# Altium schematic sheet pcie_power.SchDoc: PCIe bridge
size 297 x 209 mm; CheckedBy: MC, TW, EB; CompanyName: CERN; DrawnBy: Greg Kasprowicz; Organization: CERN; Address1: European Organization for Nuclear Research; Address2: CH-1211 Geneve 23 - Switzerland; DocumentNumber: 13; Revision: -; SheetNumber: 13; SheetTotal: 17; EDA_Number: EDA-02189-V4-0; Projet: Simple PCIe Carrier Board; Title2: Power supplies; Designer: GK, MC, TW, EB, PAS; DivGrp: BE-CO; CreateDate: 10/07/2010; CheckedDate: 11/05/2011; ModifiedBy: TW, MC; DocumentName: pcie_power.SchDoc
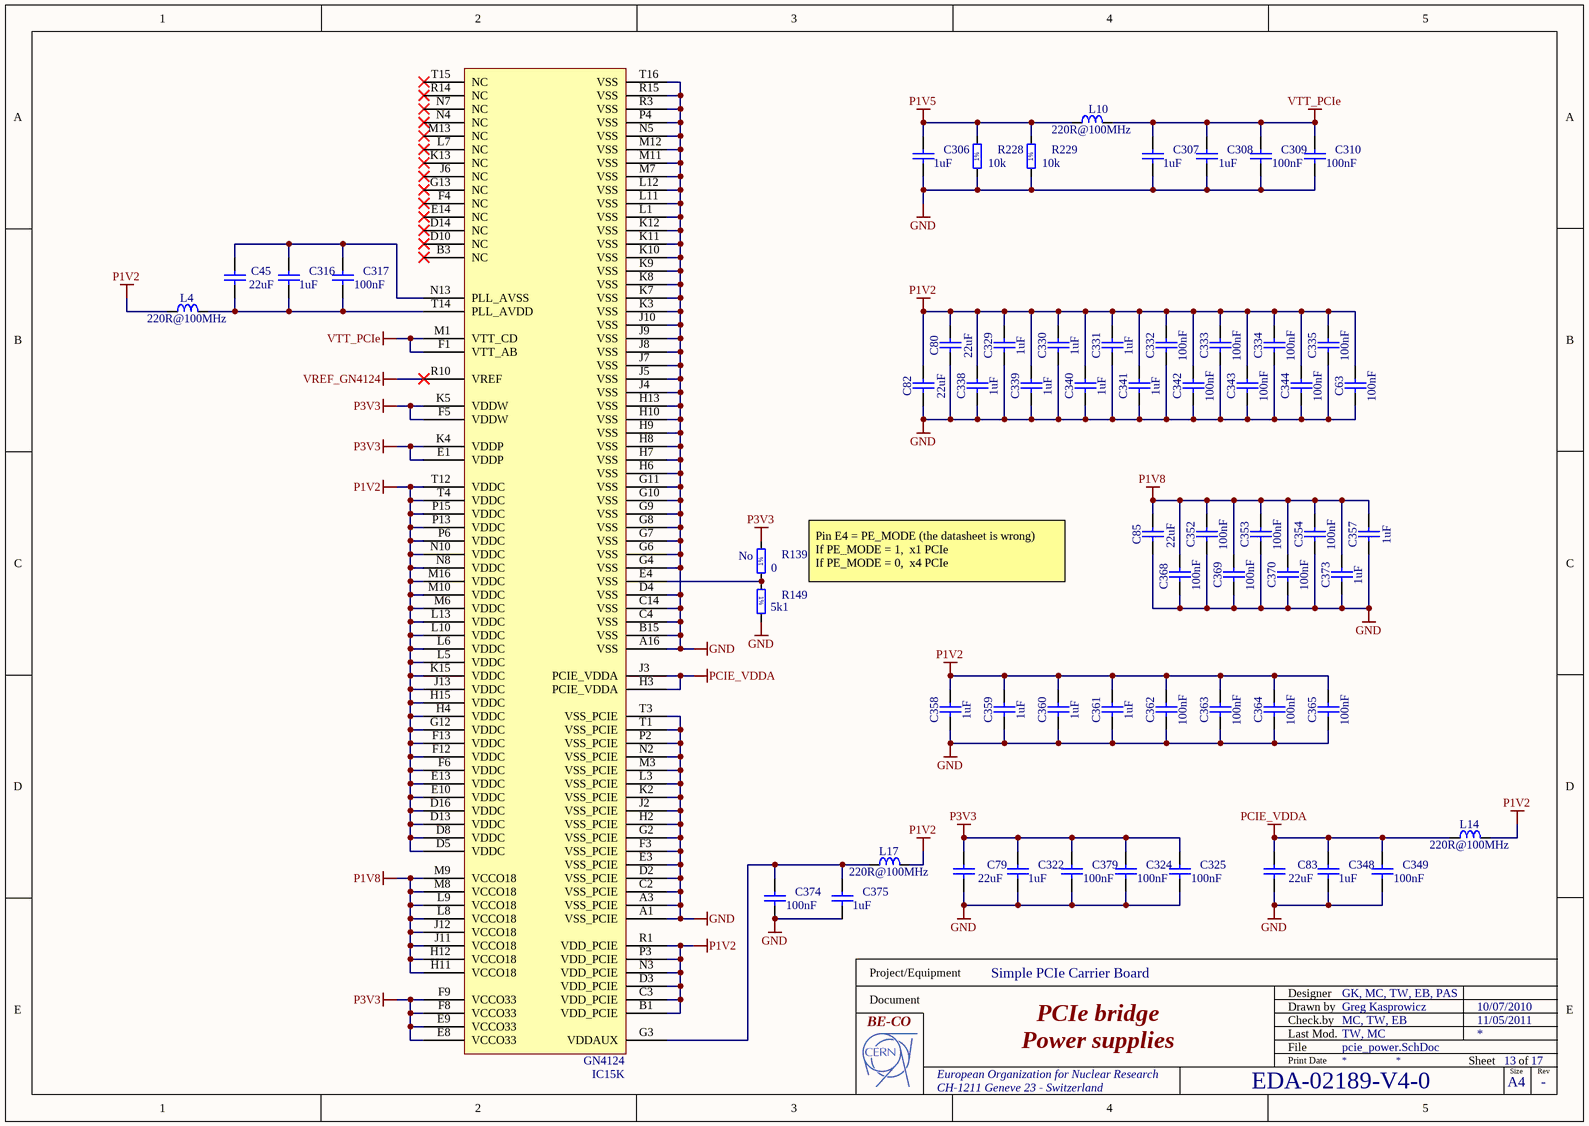
[diagram p0: pcie_power.SchDoc]

## Parts
C45  22uF  [CAPC3216X180N]
C63  100nF  [CAPC1005X55N]
C79  22uF  [CAPC3216X180N]
C80  22uF  [CAPC3216X180N]
C82  22uF  [CAPC3216X180N]
C83  22uF  [CAPC3216X180N]
C85  22uF  [CAPC3216X180N]
C306  1uF  [CAPC1608X87N]
C307  1uF  [CAPC1608X87N]
C308  1uF  [CAPC1608X87N]
C309  100nF  [CAPC1005X55N]
C310  100nF  [CAPC1005X55N]
C316  1uF  [CAPC1608X87N]
C317  100nF  [CAPC1005X55N]
C322  1uF  [CAPC1608X87N]
C324  100nF  [CAPC1005X55N]
C325  100nF  [CAPC1005X55N]
C329  1uF  [CAPC1608X87N]
C330  1uF  [CAPC1608X87N]
C331  1uF  [CAPC1608X87N]
C332  100nF  [CAPC1005X55N]
C333  100nF  [CAPC1005X55N]
C334  100nF  [CAPC1005X55N]
C335  100nF  [CAPC1005X55N]
C338  1uF  [CAPC1608X87N]
C339  1uF  [CAPC1608X87N]
C340  1uF  [CAPC1608X87N]
C341  1uF  [CAPC1608X87N]
C342  100nF  [CAPC1005X55N]
C343  100nF  [CAPC1005X55N]
C344  100nF  [CAPC1005X55N]
C348  1uF  [CAPC1608X87N]
C349  100nF  [CAPC1005X55N]
C352  100nF  [CAPC1005X55N]
C353  100nF  [CAPC1005X55N]
C354  100nF  [CAPC1005X55N]
C357  1uF  [CAPC1608X87N]
C358  1uF  [CAPC1608X87N]
C359  1uF  [CAPC1608X87N]
C360  1uF  [CAPC1608X87N]
C361  1uF  [CAPC1608X87N]
C362  100nF  [CAPC1005X55N]
C363  100nF  [CAPC1005X55N]
C364  100nF  [CAPC1005X55N]
C365  100nF  [CAPC1005X55N]
C368  100nF  [CAPC1005X55N]
C369  100nF  [CAPC1005X55N]
C370  100nF  [CAPC1005X55N]
C373  1uF  [CAPC1608X87N]
C374  100nF  [CAPC1005X55N]
C375  1uF  [CAPC1608X87N]
C379  100nF  [CAPC1005X55N]
IC15  GN4124  [BGA256C100P16X16_1700X1700X150]  (part K of 11)
L4  220R@100MHz  [INDC2012X105N]
L10  220R@100MHz  [INDC2012X105N]
L14  220R@100MHz  [INDC2012X105N]
L17  220R@100MHz  [INDC2012X105N]
R139  0  Mounted: No  [RESC1608X55N]
R149  5k1  [RESC1608X55N]
R228  10k  [RESC1608X55N]
R229  10k  [RESC1608X55N]

## Nets
GND: C63.1 C79.1 C80.1 C82.1 C83.1 C85.1 C306.1 C307.1 C308.1 C309.1 C310.1 C322.1 C324.1 C325.1 C329.1 C330.1 C331.1 C332.1 C333.1 C334.1 C335.1 C338.1 C339.1 C340.1 C341.1 C342.1 C343.1 C344.1 C348.1 C349.1 C352.1 C353.1 C354.1 C357.1 C358.1 C359.1 C360.1 C361.1 C362.1 C363.1 C364.1 C365.1 C368.2 C369.1 C370.1 C373.1 C374.1 C375.1 C379.1 IC15.A1(VSS_PCIE) IC15.A3(VSS_PCIE) IC15.A16(VSS) IC15.B15(VSS) IC15.C2(VSS_PCIE) IC15.C4(VSS) IC15.C14(VSS) IC15.D2(VSS_PCIE) IC15.D4(VSS) IC15.E3(VSS_PCIE) IC15.F3(VSS_PCIE) IC15.G2(VSS_PCIE) IC15.G4(VSS) IC15.G6(VSS) IC15.G7(VSS) IC15.G8(VSS) IC15.G9(VSS) IC15.G10(VSS) IC15.G11(VSS) IC15.H2(VSS_PCIE) IC15.H6(VSS) IC15.H7(VSS) IC15.H8(VSS) IC15.H9(VSS) IC15.H10(VSS) IC15.H13(VSS) IC15.J2(VSS_PCIE) IC15.J4(VSS) IC15.J5(VSS) IC15.J7(VSS) IC15.J8(VSS) IC15.J9(VSS) IC15.J10(VSS) IC15.K2(VSS_PCIE) IC15.K3(VSS) IC15.K7(VSS) IC15.K8(VSS) IC15.K9(VSS) IC15.K10(VSS) IC15.K11(VSS) IC15.K12(VSS) IC15.L1(VSS) IC15.L3(VSS_PCIE) IC15.L11(VSS) IC15.L12(VSS) IC15.M3(VSS_PCIE) IC15.M7(VSS) IC15.M11(VSS) IC15.M12(VSS) IC15.N2(VSS_PCIE) IC15.N5(VSS) IC15.P2(VSS_PCIE) IC15.P4(VSS) IC15.R3(VSS) IC15.R15(VSS) IC15.T1(VSS_PCIE) IC15.T3(VSS_PCIE) IC15.T16(VSS) R149.2 R228.1 R229.1
P1V2: C63.2 C80.2 C82.2 C329.2 C330.2 C331.2 C332.2 C333.2 C334.2 C335.2 C338.2 C339.2 C340.2 C341.2 C342.2 C343.2 C344.2 C358.2 C359.2 C360.2 C361.2 C362.2 C363.2 C364.2 C365.2 IC15.B1(VDD_PCIE) IC15.C3(VDD_PCIE) IC15.D3(VDD_PCIE) IC15.D5(VDDC) IC15.D8(VDDC) IC15.D13(VDDC) IC15.D16(VDDC) IC15.E10(VDDC) IC15.E13(VDDC) IC15.F6(VDDC) IC15.F12(VDDC) IC15.F13(VDDC) IC15.G12(VDDC) IC15.H4(VDDC) IC15.H15(VDDC) IC15.J13(VDDC) IC15.K15(VDDC) IC15.L5(VDDC) IC15.L6(VDDC) IC15.L10(VDDC) IC15.L13(VDDC) IC15.M6(VDDC) IC15.M10(VDDC) IC15.M16(VDDC) IC15.N3(VDD_PCIE) IC15.N8(VDDC) IC15.N10(VDDC) IC15.P3(VDD_PCIE) IC15.P6(VDDC) IC15.P13(VDDC) IC15.P15(VDDC) IC15.R1(VDD_PCIE) IC15.T4(VDDC) IC15.T12(VDDC) L4.1 L14.2 L17.2
P1V5: C306.2 L10.1 R228.2 R229.2
P1V8: C85.2 C352.2 C353.2 C354.2 C357.2 C368.1 C369.2 C370.2 C373.2 IC15.H11(VCCO18) IC15.H12(VCCO18) IC15.J11(VCCO18) IC15.J12(VCCO18) IC15.L8(VCCO18) IC15.L9(VCCO18) IC15.M8(VCCO18) IC15.M9(VCCO18)
P3V3: C79.2 C322.2 C324.2 C325.2 C379.2 IC15.E1(VDDP) IC15.E8(VCCO33) IC15.E9(VCCO33) IC15.F5(VDDW) IC15.F8(VCCO33) IC15.F9(VCCO33) IC15.K4(VDDP) IC15.K5(VDDW) R139.2
PCIE_VDDA: C83.2 C348.2 C349.2 IC15.H3(PCIE_VDDA) IC15.J3(PCIE_VDDA) L14.1
VREF_GN4124: IC15.R10(VREF)
VTT_PCIe: C307.2 C308.2 C309.2 C310.2 IC15.F1(VTT_AB) IC15.M1(VTT_CD) L10.2
NetC45_1: C45.1 C316.2 C317.2 IC15.N13(PLL_AVSS)
NetC45_2: C45.2 C316.1 C317.1 IC15.T14(PLL_AVDD) L4.2
NetC374_2: C374.2 C375.2 IC15.G3(VDDAUX) L17.1
NetIC15_E4: IC15.E4(VSS) R139.1 R149.1

Not connected (* = marked no-connect by the designer): IC15 B3(NC)* D10(NC)* D14(NC)* E14(NC)* F4(NC)* G13(NC)* J6(NC)* K13(NC)* L7(NC)* M13(NC)* N4(NC)* N7(NC)* R14(NC)* T15(NC)*

## Notes on the sheet
- Pin E4 = PE_MODE (the datasheet is wrong)
  If PE_MODE = 1,  x1 PCIe
  If PE_MODE = 0,  x4 PCIe
- Project/Equipment
- Document
- Designer
- Drawn by
- Check.by
- File
- Last Mod.
- Print Date
- Sheet
- Size
- A4
- of
- Rev
- (in symbol R0603_0R_JUMPER) 1%
- (in symbol R0603_5K1_1%_0.1W_100PPM) 1%
- (in symbol R0603_10K_1%_0.1W_100PPM) 1%

## Library data of the parts
C45 C79 C80 C82 C83 C85 = CC1206_22UF_10V_10%_X7R: Non-polarised capacitor; Part Description: SMD Multilayer Chip Ceramic Capacitor; Manufacturer: GENERIC; Manufacturer1 Part Number: GRM31CR71A226KE15L; Voltage: 10V; TC: X7R; Tolerance: ±10%; Table: Capacitors SMD; Part Number: CC1206_22UF_10V_10%_X7R; Component Kind: Standard; Component Type: Standard; Pin Count: 2; Value: 22uF; Status: Preferred; Manufacturer Part Number: CC1206_22UF_10V_10%_X7R; Case: 1206; Mounted: Yes; Socket: No; SMD: Yes; Manufacturer1 Example: MURATA; Manufacturer1 ComponentHeight: 1.8mm; HelpURL: \\cern.ch\dfs\Applications\Altium\Datasheets\CC1206_X7R_MURATA_GRM-HI-CAP.pdf; Author: CERN DEM JLC; CreateDate: 2010-06-08; LatestRevisionDate: 2010-06-08
C63 C309 C310 C317 C324 C325 C332-C335 C342-C344 C349 C352-C354 C362-C365 C368-C370 C374 C379 = CC0402_100NF_16V_10%_X7R: Non-polarised capacitor; Part Description: SMD Multilayer Chip Ceramic Capacitor; Manufacturer: GENERIC; Manufacturer1 Part Number: 223878715649; Voltage: 16V; TC: X7R; Tolerance: ±10%; Table: Capacitors SMD; Part Number: CC0402_100NF_16V_10%_X7R; Component Kind: Standard; Component Type: Standard; Pin Count: 2; Value: 100nF; Status: Not Recommended; Manufacturer Part Number: CC0402_100NF_16V_10%_X7R; Case: 0402; Mounted: Yes; Socket: No; SMD: Yes; Manufacturer1 Example: PHYCOMP; Manufacturer1 ComponentHeight: 0.55mm; HelpURL: \\cern.ch\dfs\Applications\Altium\Datasheets\CC0402_X7R_PHYCOMP.pdf; Author: CERN DEM JLC; CreateDate: 12/3/2007; LatestRevisionDate: 12/3/2007
C306-C308 C316 C322 C329-C331 C338-C341 C348 C357-C361 C375 = CC0603_1UF_16V_10%_X7R: Non-polarised capacitor; Part Description: SMD Multilayer Chip Ceramic Capacitor; Manufacturer: GENERIC; Manufacturer1 Part Number: 223824613663; Voltage: 16V; TC: X7R; Tolerance: ±10%; Table: Capacitors SMD; Part Number: CC0603_1UF_16V_10%_X7R; Component Kind: Standard; Component Type: Standard; Pin Count: 2; Value: 1uF; Status: Preferred; Manufacturer Part Number: CC0603_1uF_16V_10%_X7R; Case: 0603; Mounted: Yes; Socket: No; SMD: Yes; Manufacturer1 Example: PHYCOMP; Manufacturer1 ComponentHeight: 0.87mm; HelpURL: \\cern.ch\dfs\Applications\Altium\Datasheets\CC0805_X5R_PHYCOMP_HC.pdf; Author: CERN DEM JLC
  C306: CreateDate: 03/12/2007; LatestRevisionDate: 03/12/2007
  C307 C308 C316 C322 C329-C331 C338-C341 C348 C357-C361 C375: CreateDate: 12/3/2007; LatestRevisionDate: 12/3/2007
C373 = CC0603_1UF_16V_10%_X7R: Non-polarised capacitor; Part Description: SMD Multilayer Chip Ceramic Capacitor; Manufacturer: GENERIC; Manufacturer1 Part Number: 223824613663; Manufacturer1 Datasheet: \\cern.ch\dfs\Applications\Altium\Datasheets\CC0805_X5R_PHYCOMP_HC.pdf; Voltage: 16V; TC: X7R; Tolerance: ±10%; Table: Capacitors SMD; Part Number: CC0603_1UF_16V_10%_X7R; Component Kind: Standard; Component Type: Standard; Designator: Capacitor - non polarized; Library Reference: Capacitor - non polarized; Pin Count: 2; Value: 1uF; Status: Preferred; Manufacturer Part Number: CC0603_1uF_16V_10%_X7R; Case: 0603; Mounted: Yes; Socket: No; SMD: Yes; Manufacturer1 Example: PHYCOMP; Manufacturer1 ComponentHeight: 0.87mm; HelpURL: \\cern.ch\dfs\Applications\Altium\Datasheets\CC0805_X5R_PHYCOMP_HC.pdf; Author: CERN DEM JLC; CreateDate: 03/12/2007; LatestRevisionDate: 03/12/2007
IC15 = GN4124: x4 Lane PCI Express to Local Bridge; Manufacturer: GENNUM; Table: Logic; Part Number: GN4124; Component Kind: Standard; Component Type: Standard; Device: GN4124; PackageDescription: BGA 1mm, Pitch, Square 256 Pin, 16 Columns x 16 Rows, Body 17mm X 17mm X 1.50mm H; Part Description: x4 Lane PCI Express to Local Bridge; Manufacturer Part Number: GN4124; Pin Count: 256; Case: BGA256; Mounted: Yes; Socket: No; SMD: Yes; ComponentHeight: 1.5mm; HelpURL: \\cern.ch\dfs\Applications\Altium\Datasheets\GN4124.pdf; Author: CERN DEM JLC; CreateDate: 02/12/2009; LatestRevisionDate: 13/04/2011
L4 L10 L14 L17 = IND0805_MURATA_BLM21PG221SN1D: Inductor; Part Description: SMD EMIFIL Suppression Chip Bead Ferrite; Manufacturer: MURATA; Power: 2A; Resistance: 0.05R; Tolerance: ±25%; Table: Inductors SMD; Part Number: IND0805_MURATA_BLM21PG221SN1D; Component Kind: Standard; Component Type: Standard; Pin Count: 2; Value: 220R@100MHz; Status: None; Manufacturer Part Number: BLM21PG221SN1D; Case: 0805; Mounted: Yes; Socket: No; SMD: Yes; ComponentHeight: 1.05mm; HelpURL: \\cern.ch\dfs\Applications\Altium\Datasheets\IND0402_MURATA_BLM21P.pdf; Author: CERN DEM JLC; CreateDate: 25/01/2010; LatestRevisionDate: 25/01/2010
R139 = R0603_0R_JUMPER: Resistor - 1%; Part Description: 1A (0.05R Max DC Resistance) Zero Ohm Jumper; Manufacturer: GENERIC; Manufacturer1 Part Number: NRC06Z0; Table: Resistors SMD; Part Number: R0603_0R_JUMPER; Component Kind: Standard; Component Type: Standard; Pin Count: 2; Value: 0; Status: Preferred; Manufacturer Part Number: R0603_0R_JUMPER; Case: 0603; Socket: No; SMD: Yes; Manufacturer1 Example: NIC COMPONENT; Manufacturer1 ComponentHeight: 0.55mm; HelpURL: \\cern.ch\dfs\Applications\Altium\Datasheets\R0603_NIC_NRC.pdf; Author: CERN DEM JLC; CreateDate: 12/3/2007; LatestRevisionDate: 3/13/2008
R149 = R0603_5K1_1%_0.1W_100PPM: Resistor - 1%; Part Description: General Purpose Thick Film Chip Resistor; Manufacturer: GENERIC; Manufacturer1 Part Number: NRC06F5101TRF; Power: 0.1W; TC: ±100ppm/°C; Table: Resistors SMD; Part Number: R0603_5K1_1%_0.1W_100PPM; Component Kind: Standard; Component Type: Standard; Pin Count: 2; Value: 5k1; Status: Preferred; Tolerance: ±1%; Manufacturer Part Number: R0603_5K1_1%_0.1W_100PPM; Case: 0603; Mounted: Yes; Socket: No; SMD: Yes; Manufacturer1 Example: NIC COMPONENT; Manufacturer1 ComponentHeight: 0.55mm; HelpURL: \\cern.ch\dfs\Applications\Altium\Datasheets\R0603_NIC_NRC.pdf; Author: CERN DEM JLC; CreateDate: 12/3/2007; LatestRevisionDate: 3/13/2008
R228 R229 = R0603_10K_1%_0.1W_100PPM: Resistor - 1%; Part Description: General Purpose Thick Film Chip Resistor; Manufacturer: GENERIC; Manufacturer1 Part Number: NRC06F1002TRF; Power: 0.1W; TC: ±100ppm/°C; Table: Resistors SMD; Part Number: R0603_10K_1%_0.1W_100PPM; Component Kind: Standard; Component Type: Standard; Pin Count: 2; Value: 10k; Status: Preferred; Tolerance: ±1%; Manufacturer Part Number: R0603_10K_1%_0.1W_100PPM; Case: 0603; Mounted: Yes; Socket: No; SMD: Yes; Manufacturer1 Example: NIC COMPONENT; Manufacturer1 ComponentHeight: 0.55mm; HelpURL: \\cern.ch\dfs\Applications\Altium\Datasheets\R0603_NIC_NRC.pdf; Author: CERN DEM JLC; CreateDate: 12/3/2007; LatestRevisionDate: 3/13/2008